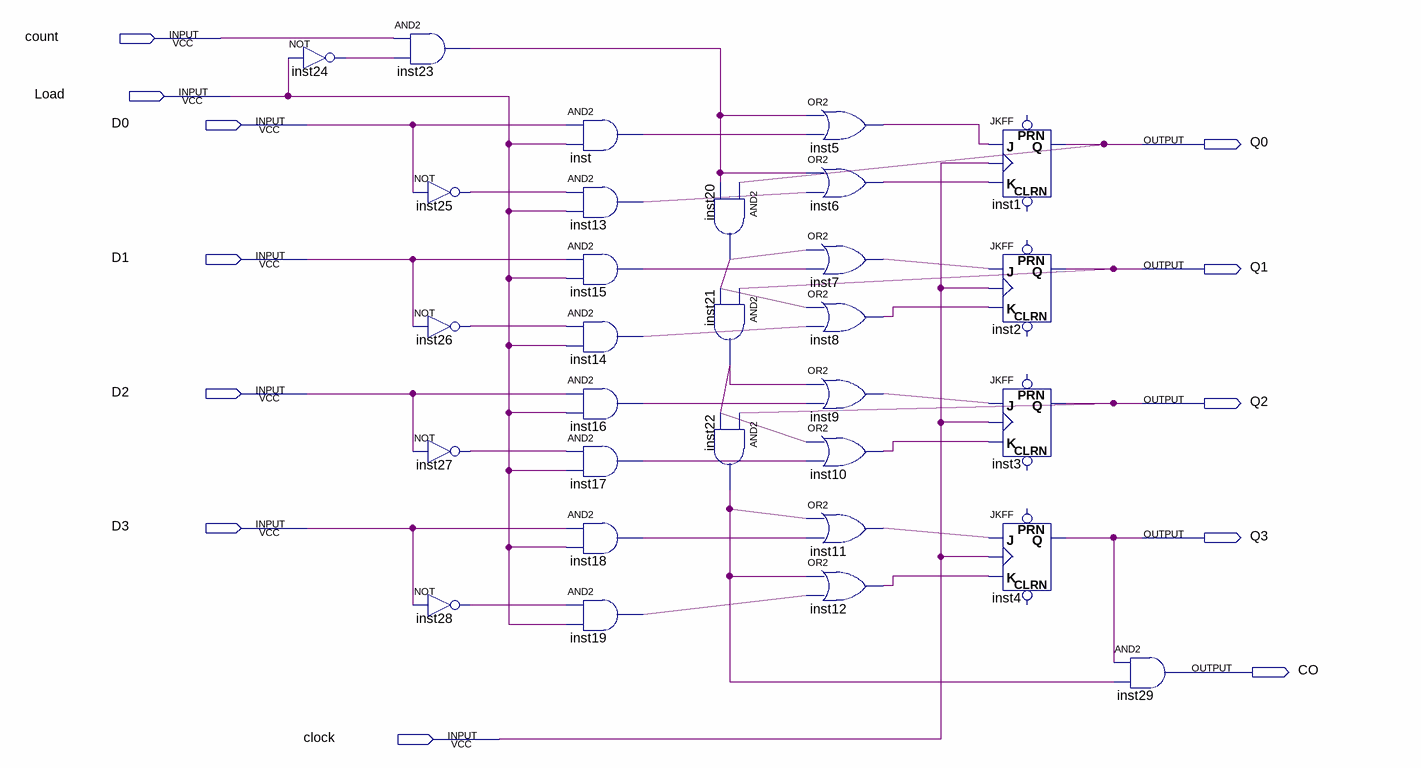
[diagram p0: schematic sheet]
// Quartus schematic Example1.bdf as structural Verilog: 30 symbols, 12 pins
module Example1 (
  input  count,
  input  Load,
  input  D0,
  input  D1,
  input  D2,
  input  D3,
  input  clock,
  output Q0,
  output Q1,
  output Q2,
  output Q3,
  output CO
);

  wire inst5_out, inst6_out, inst7_out, inst8_out, inst9_out, inst10_out, inst11_out, inst12_out, inst13_out,
       inst14_out, inst15_out, inst16_out, inst17_out, inst18_out, inst19_out, inst20_out, inst21_out,
       inst22_out, inst23_out, inst24_out, inst25_out, inst26_out, inst27_out, inst28_out, inst_out;

  not inst24 (inst24_out, Load);
  and inst23 (inst23_out, count, inst24_out);
  not inst25 (inst25_out, D0);
  not inst26 (inst26_out, D1);
  not inst27 (inst27_out, D2);
  not inst28 (inst28_out, D3);
  and inst (inst_out, D0, Load);
  and inst13 (inst13_out, inst25_out, Load);
  and inst15 (inst15_out, D1, Load);
  and inst14 (inst14_out, inst26_out, Load);
  and inst16 (inst16_out, D2, Load);
  and inst17 (inst17_out, inst27_out, Load);
  and inst18 (inst18_out, D3, Load);
  and inst19 (inst19_out, inst28_out, Load);
  and inst20 (inst20_out, Q0, inst23_out);
  and inst21 (inst21_out, Q1, inst20_out);
  and inst22 (inst22_out, Q2, inst21_out);
  or inst5 (inst5_out, inst23_out, inst_out);
  or inst6 (inst6_out, inst23_out, inst13_out);
  or inst7 (inst7_out, inst20_out, inst15_out);
  or inst8 (inst8_out, inst20_out, inst14_out);
  or inst9 (inst9_out, inst21_out, inst16_out);
  or inst10 (inst10_out, inst21_out, inst17_out);
  or inst11 (inst11_out, inst22_out, inst18_out);
  or inst12 (inst12_out, inst22_out, inst19_out);
  JKFF inst1 (.K(inst6_out), .J(inst5_out), .CLK(clock), .Q(Q0));  // open: PRN, CLRN
  JKFF inst2 (.K(inst8_out), .J(inst7_out), .CLK(clock), .Q(Q1));  // open: PRN, CLRN
  JKFF inst3 (.K(inst10_out), .J(inst9_out), .CLK(clock), .Q(Q2));  // open: PRN, CLRN
  JKFF inst4 (.K(inst12_out), .J(inst11_out), .CLK(clock), .Q(Q3));  // open: PRN, CLRN
  and inst29 (CO, Q3, inst22_out);
endmodule
